# Altium schematic sheet CANTermination.SchDoc
size A
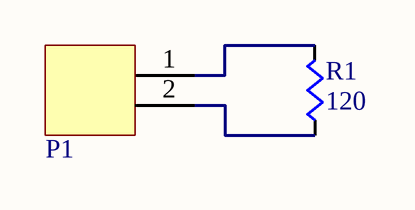
[diagram p0: CANTermination.SchDoc]

## Parts
P1  2-pin Horz Sherlock  [MOLEX-HDR-1X2-SHERLOCK-HORZ]  (value not drawn)
R1  value 120  [RES0603]  (hidden comment: Res)

## Nets
NetP1_1: P1.1 R1.1(A)
NetP1_2: P1.2 R1.2(B)

## Library data of the parts
P1 = MOLEX-HDR-1x2-SHERLOCK_RA: Header, Molex, 2mm Pitch Sherlock Header, Single Row, Horizontal, 2 Circuits, Length 3.3mm,  0353630260; Manufacturer: Molex Inc; Manufacturer Part Number: 0353630260; Supplier Part Number 1: WM18931-ND; Supplier 1: Digi-Key
R1 = Res: Supplier 1: Digi-Key